# EAGLE schematic MotorController (EAGLE 7.2.0)
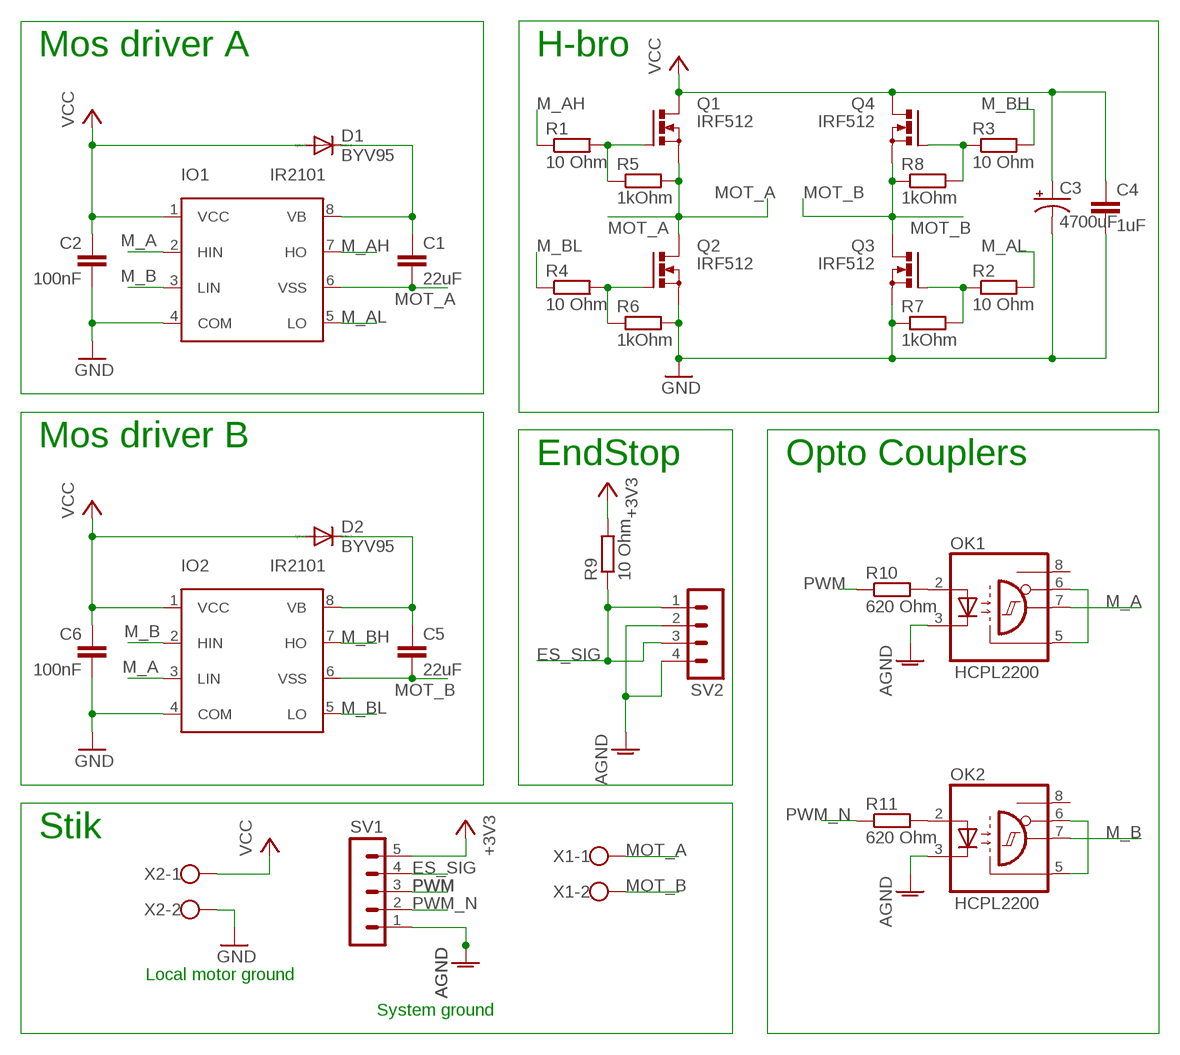
[diagram p0: schematic, sheet 1]

## Parts
C1  22uF  CAPPTH1  [CAP-PTH-5MM]
C2  100nF  CAPPTH1  [CAP-PTH-5MM]
C3  4700uF  CAP_POLPTH4  [CPOL-RADIAL-1000UF-25V]
C4  1uF  CAPPTH1  [CAP-PTH-5MM]
C5  22uF  CAPPTH1  [CAP-PTH-5MM]
C6  100nF  CAPPTH1  [CAP-PTH-5MM]
D1  BYV95  [SOD57-10]
D2  BYV95  [SOD57-10]
IO1  IR2101  [DIL08]
IO2  IR2101  [DIL08]
OK1  HCPL2200  [DIL08]
OK2  HCPL2200  [DIL08]
Q1  IRF512  [TO220BV]
Q2  IRF512  [TO220BV]
Q3  IRF512  [TO220BV]
Q4  IRF512  [TO220BV]
R1  10 Ohm  R-EU_0207/10  [0207/10]
R2  10 Ohm  R-EU_0207/10  [0207/10]
R3  10 Ohm  R-EU_0207/10  [0207/10]
R4  10 Ohm  R-EU_0207/10  [0207/10]
R5  1kOhm  R-EU_0207/10  [0207/10]
R6  1kOhm  R-EU_0207/10  [0207/10]
R7  1kOhm  R-EU_0207/10  [0207/10]
R8  1kOhm  R-EU_0207/10  [0207/10]
R9  10 Ohm  R-EU_0207/10  [0207/10]
R10  620 Ohm  R-EU_0207/10  [0207/10]
R11  620 Ohm  R-EU_0207/10  [0207/10]
SV1  MA05-1  [MA05-1]
SV2  MA04-1  [MA04-1]
X1  W237-102  [W237-102]
X2  W237-102  [W237-102]

## Nets
+3V3: R9.2 SV1.5
AGND: OK1.3(C) OK2.3(C) SV1.1 SV2.2 SV2.4
ES_SIG: R9.1 SV1.4 SV2.1 SV2.3
GND: C2.2 C3.2(-) C4.2 C6.2 IO1.4(COM) IO2.4(COM) Q2.S Q3.S R6.2 R7.1 X2.2
M_A: IO1.2(HIN) IO2.3(LIN) OK1.7(VO)
M_AH: IO1.7(HO) R1.1
M_AL: IO1.5(LO) R2.2
M_B: IO1.3(LIN) IO2.2(HIN) OK2.7(VO)
M_BH: IO2.7(HO) R3.2
M_BL: IO2.5(LO) R4.1
MOT_A: C1.2 IO1.6(VSS) Q1.S Q2.D R5.2 X1.1
MOT_B: C5.2 IO2.6(VSS) Q3.D Q4.S R8.1 X1.2
N$2: C5.1 D2.C IO2.8(VB)
N$3: Q1.G R1.2 R5.1
N$4: Q2.G R4.2 R6.1
N$5: Q4.G R3.1 R8.2
N$6: Q3.G R2.1 R7.2
N$8: C1.1 D1.C IO1.8(VB)
N$10: OK1.2(A) R10.2
N$11: OK2.2(A) R11.2
N$14: OK2.5(GND) OK2.6(VE)
N$16: OK1.5(GND) OK1.6(VE)
PWM: R10.1 SV1.3
PWM_N: R11.1 SV1.2
VCC: C2.1 C3.1(+) C4.1 C6.1 D1.A D2.A IO1.1(VCC) IO2.1(VCC) Q1.D Q4.D X2.1
Unconnected: OK1.8(VCC) OK2.8(VCC)

## Notes on the sheet
- Mos driver A | H-bro
- Mos driver B
- EndStop | Opto Couplers
- Stik
- Local motor ground
- System ground

## Library data of the parts
C1 C2 C4-C6 = SparkFun-Passives:CAP: Capacitor Standard 0603 ceramic capacitor, and 0.1" leaded capacitor.
C3 = SparkFun-Passives:CAP_POL: Capacitor Polarized These are standard SMD and PTH capacitors. Normally 10uF, 47uF, and 100uF in electrolytic and tantalum varieties. Always verify the external diameter of the through hole cap, it varies with capacity, voltage, and manufacturer. The EIA devices should be standard.
D1 D2 = diode:BYV95: DIODE fast soft-recovery controlled avalanche rectifier
IO1 IO2 = drivers:IR2101: IR2101 HIGH AND LOW SIDE DRIVER Product Summary VOFFSET 600V max. IO+/- 130 mA / 270 mA VOUT 10 - 20V ton/off (typ.) 160 & 150 ns Delay Matching 50 ns IR2101(S)/IR2102(S) & (PbF) Features ? Floating channel designed for bootstrap operation Fully operational to +600V Tolerant to negative transient voltage dV/dt immune ? Gate drive supply range from 10 to 20V ? Undervoltage lockout ? 3.3V, 5V, and 15V logic input compatible ? Matched propagation delay for both channels ? Outputs in phase with inputs (IR2101) or out of phase with inputs (IR2102) ? Also available LEAD-FREE Description The IR2101(S)/IR2102(S) are high voltage, high speed power MOSFET and IGBT drivers with independent high and low side referenced output channels. Proprietary HVIC and latch immune CMOS technologies enable ruggedized monolithic construction. The logic input is compatible with standard CMOS or LSTTL output, down to 3.3V logic. The output drivers feature a high pulse current buffer stage designed for minimum driver cross-conduction. The floating channel can be used to drive an N-channel power MOSFET or IGBT in the high side configuration which operates up to 600 volts.
OK1 OK2 = optocoupler:HCPL2200: HEWLETT PACKARD OPTO COUPLER; MF: AGILENT TECHNOLOGIES; MPN: HCPL-2200; OC_FARNELL: 326720; OC_NEWARK: 06F5425
Q1-Q4 = transistor-power:IRF512: N-CHANNEL MOS FET
R1-R11 = rcl:R-EU_: RESISTOR, European symbol
SV1 = con-lstb:MA05-1: PIN HEADER; OC_FARNELL: unknown; OC_NEWARK: unknown
SV2 = con-lstb:MA04-1: PIN HEADER; OC_FARNELL: unknown; OC_NEWARK: unknown
X1 X2 = con-wago-500:W237-102: WAGO SCREW CLAMP; MPN: 237-102; OC_FARNELL: unknown; OC_NEWARK: 70K9898